# Altium project rf_modulator_source.PrjPcb (part 2 of 2)

## Sheet rf_modulator_source_temp_regulator.SchDoc: SPE Router
size 420 x 297 mm; Author: P. Daniel; CompanyName: WUT ISE; DrawnBy: P. Daniel; Organization: WUT ISE; Address1: WUT ISE; Address2: Nowowiejska 15/19 00-665 Warsaw; Address3: piotrmaciejdaniel@gmail.com; Revision: 1; SheetNumber: 2; SheetTotal: 2; ModifiedBy: -; CreateDate: 02-03.2023; CheckedDate: -; Title2: PoE power supply; DivGrp: WUT ISE; Designer: Piotr Daniel
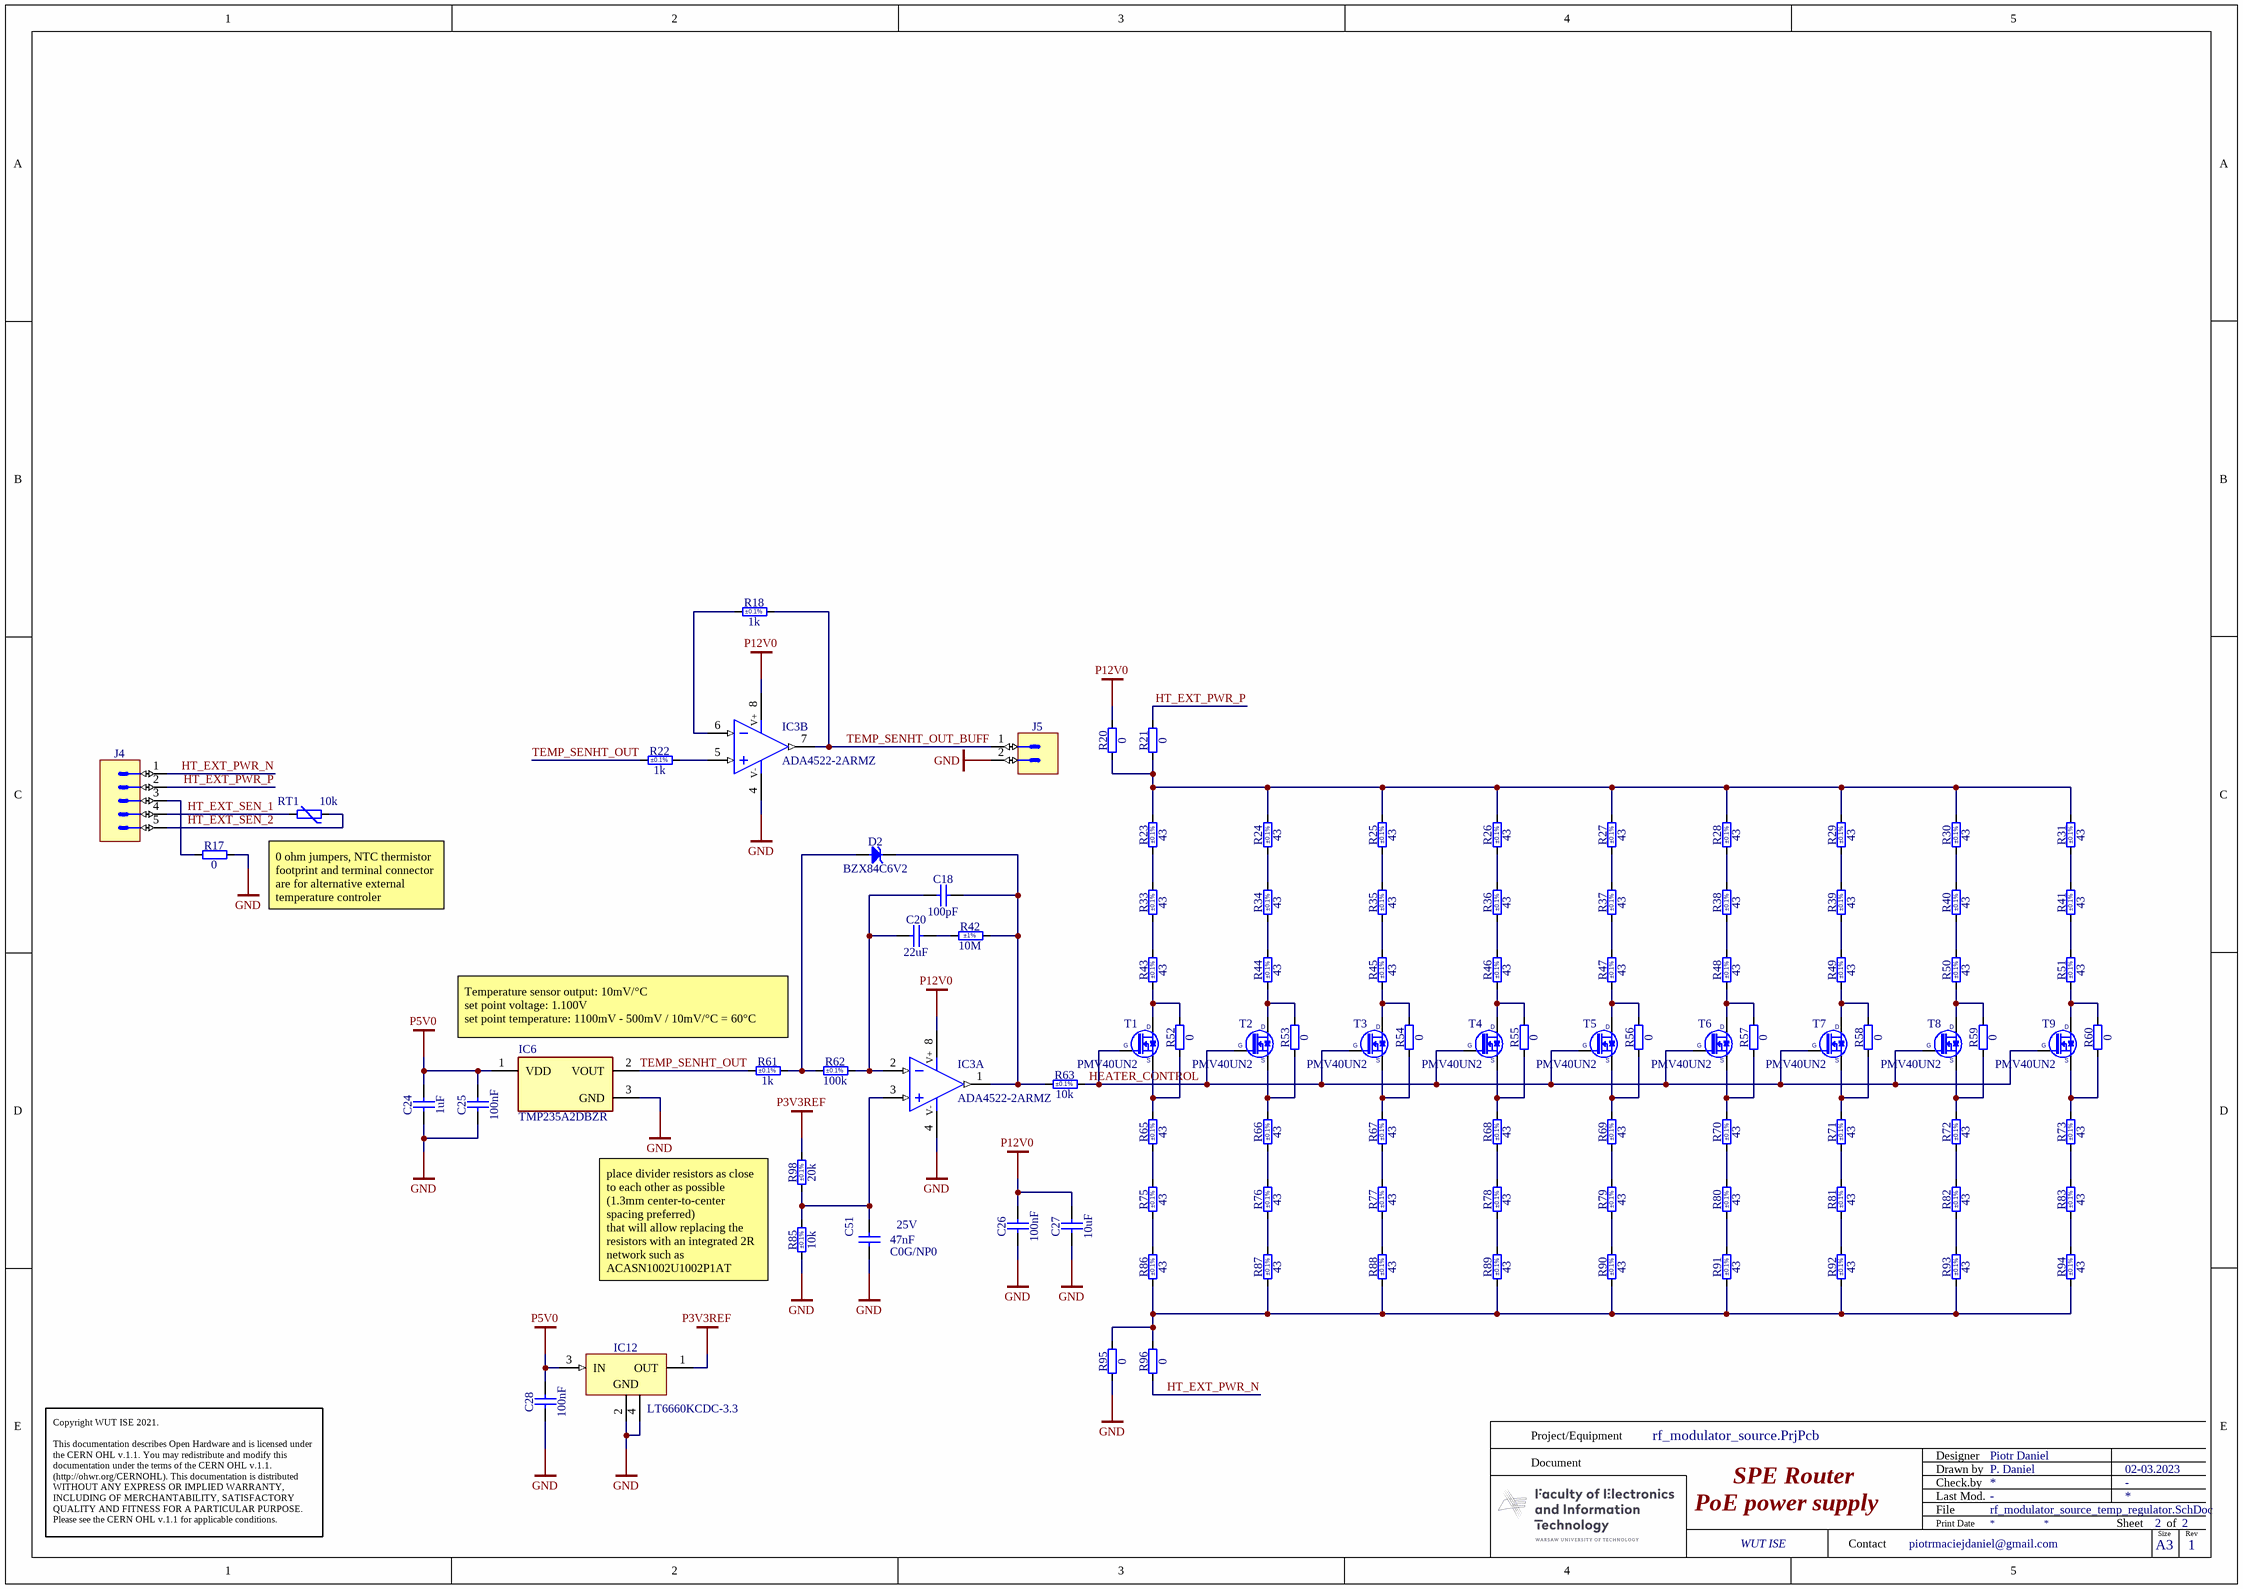
[diagram p1: rf_modulator_source_temp_regulator.SchDoc]

### Parts
C18  100pF  [CAPC1608X87N]
C20  22uF  [CAPC2012X135N]
C24  1uF  [CAPC1608X87N]
C25  100nF  [CAPC1005X55N]
C26  100nF  [CAPC1005X55N]
C27  10uF  [CAPC2012X135N]
C28  100nF  [CAPC1005X55N]
C51  47nF  Voltage: 25V  TC: C0G/NP0  [CAPC2012X135N]
D2  BZX84C6V2  [SOT95P248X115-3N]
IC3  ADA4522-2ARMZ  [SOP65P490X110-8N]  (parts A,B of 2)
IC6  TMP235A2DBZR  [FP-DBZ0003A-MFG]
IC12  LT6660KCDC-3.3  [ANALOG-DEVICES_DC-4]
J4  (no value)  [PHOENIX_1803303]
J5  KK®  [MOLEX_22-05-7028]  (value not drawn)
R17  0  [RESC2012X60N]
R18  1k  Tolerance: ±0.1%  [RESC1608X55N]
R20  0  [RESC2012X60N]
R21  0  [RESC2012X60N]
R22  1k  Tolerance: ±0.1%  [RESC1608X55N]
R23  43  Tolerance: ±0.1%  [RESC3216X65N]
R24  43  Tolerance: ±0.1%  [RESC3216X65N]
R25  43  Tolerance: ±0.1%  [RESC3216X65N]
R26  43  Tolerance: ±0.1%  [RESC3216X65N]
R27  43  Tolerance: ±0.1%  [RESC3216X65N]
R28  43  Tolerance: ±0.1%  [RESC3216X65N]
R29  43  Tolerance: ±0.1%  [RESC3216X65N]
R30  43  Tolerance: ±0.1%  [RESC3216X65N]
R31  43  Tolerance: ±0.1%  [RESC3216X65N]
R33  43  Tolerance: ±0.1%  [RESC3216X65N]
R34  43  Tolerance: ±0.1%  [RESC3216X65N]
R35  43  Tolerance: ±0.1%  [RESC3216X65N]
R36  43  Tolerance: ±0.1%  [RESC3216X65N]
R37  43  Tolerance: ±0.1%  [RESC3216X65N]
R38  43  Tolerance: ±0.1%  [RESC3216X65N]
R39  43  Tolerance: ±0.1%  [RESC3216X65N]
R40  43  Tolerance: ±0.1%  [RESC3216X65N]
R41  43  Tolerance: ±0.1%  [RESC3216X65N]
R42  10M  Tolerance: ±1%  [RESC1608X55N]
R43  43  Tolerance: ±0.1%  [RESC3216X65N]
R44  43  Tolerance: ±0.1%  [RESC3216X65N]
R45  43  Tolerance: ±0.1%  [RESC3216X65N]
R46  43  Tolerance: ±0.1%  [RESC3216X65N]
R47  43  Tolerance: ±0.1%  [RESC3216X65N]
R48  43  Tolerance: ±0.1%  [RESC3216X65N]
R49  43  Tolerance: ±0.1%  [RESC3216X65N]
R50  43  Tolerance: ±0.1%  [RESC3216X65N]
R51  43  Tolerance: ±0.1%  [RESC3216X65N]
R52  0  [RESC1608X55N]
R53  0  [RESC1608X55N]
R54  0  [RESC1608X55N]
R55  0  [RESC1608X55N]
R56  0  [RESC1608X55N]
R57  0  [RESC1608X55N]
R58  0  [RESC1608X55N]
R59  0  [RESC1608X55N]
R60  0  [RESC1608X55N]
R61  1k  Tolerance: ±0.1%  [RESC1608X55N]
R62  100k  Tolerance: ±0.1%  [RESC1608X55N]
R63  10k  Tolerance: ±0.1%  [RESC1608X55N]
R65  43  Tolerance: ±0.1%  [RESC3216X65N]
R66  43  Tolerance: ±0.1%  [RESC3216X65N]
R67  43  Tolerance: ±0.1%  [RESC3216X65N]
R68  43  Tolerance: ±0.1%  [RESC3216X65N]
R69  43  Tolerance: ±0.1%  [RESC3216X65N]
R70  43  Tolerance: ±0.1%  [RESC3216X65N]
R71  43  Tolerance: ±0.1%  [RESC3216X65N]
R72  43  Tolerance: ±0.1%  [RESC3216X65N]
R73  43  Tolerance: ±0.1%  [RESC3216X65N]
R75  43  Tolerance: ±0.1%  [RESC3216X65N]
R76  43  Tolerance: ±0.1%  [RESC3216X65N]
R77  43  Tolerance: ±0.1%  [RESC3216X65N]
R78  43  Tolerance: ±0.1%  [RESC3216X65N]
R79  43  Tolerance: ±0.1%  [RESC3216X65N]
R80  43  Tolerance: ±0.1%  [RESC3216X65N]
R81  43  Tolerance: ±0.1%  [RESC3216X65N]
R82  43  Tolerance: ±0.1%  [RESC3216X65N]
R83  43  Tolerance: ±0.1%  [RESC3216X65N]
R85  10k  Tolerance: ±0.1%  [RESC1608X55N]
R86  43  Tolerance: ±0.1%  [RESC3216X65N]
R87  43  Tolerance: ±0.1%  [RESC3216X65N]
R88  43  Tolerance: ±0.1%  [RESC3216X65N]
R89  43  Tolerance: ±0.1%  [RESC3216X65N]
R90  43  Tolerance: ±0.1%  [RESC3216X65N]
R91  43  Tolerance: ±0.1%  [RESC3216X65N]
R92  43  Tolerance: ±0.1%  [RESC3216X65N]
R93  43  Tolerance: ±0.1%  [RESC3216X65N]
R94  43  Tolerance: ±0.1%  [RESC3216X65N]
R95  0  [RESC2012X60N]
R96  0  [RESC2012X60N]
R98  20k  Tolerance: ±0.1%  [RESC1608X55N]
RT1  10k  [THERMC1608X90N]
T1  PMV40UN2  [SOT95P230X110-3N]
T2  PMV40UN2  [SOT95P230X110-3N]
T3  PMV40UN2  [SOT95P230X110-3N]
T4  PMV40UN2  [SOT95P230X110-3N]
T5  PMV40UN2  [SOT95P230X110-3N]
T6  PMV40UN2  [SOT95P230X110-3N]
T7  PMV40UN2  [SOT95P230X110-3N]
T8  PMV40UN2  [SOT95P230X110-3N]
T9  PMV40UN2  [SOT95P230X110-3N]

### Nets
GND: C24.1 C25.1 C26.1 C27.1 C28.1 C51.1 IC3.4(V-) IC6.3(GND) IC12.2(GND) IC12.4(GND) J5.2 R17.2 R85.1 R95.1
P3V3REF: IC12.1(OUT) R98.2
P5V0: C24.2 C25.2 C28.2 IC6.1(VDD) IC12.3(IN)
P12V0: C26.2 C27.2 IC3.8(V+) R20.2
HEATER_CONTROL: R63.2 T1.1(G) T2.1(G) T3.1(G) T4.1(G) T5.1(G) T6.1(G) T7.1(G) T8.1(G) T9.1(G)
HT_EXT_PWR_N: J4.1 R96.1
HT_EXT_PWR_P: J4.2 R21.2
HT_EXT_SEN_1: J4.4 RT1.1
HT_EXT_SEN_2: J4.5 RT1.2
TEMP_SENHT_OUT: IC6.2(VOUT) R22.1 R61.1
TEMP_SENHT_OUT_BUFF: IC3.7(OUT) J5.1 R18.2
NetC18_1: C18.1 C20.1 IC3.2(IN-) R62.2
NetC18_2: C18.2 D2.3(C) IC3.1(OUT) R42.2 R63.1
NetC20_2: C20.2 R42.1
NetC51_2: C51.2 IC3.3(IN+) R85.2 R98.1
NetD2_1: D2.1(A) R61.2 R62.1
NetIC3_5: IC3.5(IN+) R22.2
NetIC3_6: IC3.6(IN-) R18.1
NetJ4_3: J4.3 R17.1
NetR20_1: R20.1 R21.1 R23.2 R24.2 R25.2 R26.2 R27.2 R28.2 R29.2 R30.2 R31.2
NetR23_1: R23.1 R33.2
NetR24_1: R24.1 R34.2
NetR25_1: R25.1 R35.2
NetR26_1: R26.1 R36.2
NetR27_1: R27.1 R37.2
NetR28_1: R28.1 R38.2
NetR29_1: R29.1 R39.2
NetR30_1: R30.1 R40.2
NetR31_1: R31.1 R41.2
NetR33_1: R33.1 R43.2
NetR34_1: R34.1 R44.2
NetR35_1: R35.1 R45.2
NetR36_1: R36.1 R46.2
NetR37_1: R37.1 R47.2
NetR38_1: R38.1 R48.2
NetR39_1: R39.1 R49.2
NetR40_1: R40.1 R50.2
NetR41_1: R41.1 R51.2
NetR43_1: R43.1 R52.2 T1.3(D)
NetR44_1: R44.1 R53.2 T2.3(D)
NetR45_1: R45.1 R54.2 T3.3(D)
NetR46_1: R46.1 R55.2 T4.3(D)
NetR47_1: R47.1 R56.2 T5.3(D)
NetR48_1: R48.1 R57.2 T6.3(D)
NetR49_1: R49.1 R58.2 T7.3(D)
NetR50_1: R50.1 R59.2 T8.3(D)
NetR51_1: R51.1 R60.2 T9.3(D)
NetR52_1: R52.1 R65.2 T1.2(S)
NetR53_1: R53.1 R66.2 T2.2(S)
NetR54_1: R54.1 R67.2 T3.2(S)
NetR55_1: R55.1 R68.2 T4.2(S)
NetR56_1: R56.1 R69.2 T5.2(S)
NetR57_1: R57.1 R70.2 T6.2(S)
NetR58_1: R58.1 R71.2 T7.2(S)
NetR59_1: R59.1 R72.2 T8.2(S)
NetR60_1: R60.1 R73.2 T9.2(S)
NetR65_1: R65.1 R75.2
NetR66_1: R66.1 R76.2
NetR67_1: R67.1 R77.2
NetR68_1: R68.1 R78.2
NetR69_1: R69.1 R79.2
NetR70_1: R70.1 R80.2
NetR71_1: R71.1 R81.2
NetR72_1: R72.1 R82.2
NetR73_1: R73.1 R83.2
NetR75_1: R75.1 R86.2
NetR76_1: R76.1 R87.2
NetR77_1: R77.1 R88.2
NetR78_1: R78.1 R89.2
NetR79_1: R79.1 R90.2
NetR80_1: R80.1 R91.2
NetR81_1: R81.1 R92.2
NetR82_1: R82.1 R93.2
NetR83_1: R83.1 R94.2
NetR86_1: R86.1 R87.1 R88.1 R89.1 R90.1 R91.1 R92.1 R93.1 R94.1 R95.2 R96.2

### Notes on the sheet
- 0 ohm jumpers, NTC thermistor footprint and terminal connector are for alternative external temperature controler
- Temperature sensor output: 10mV/°C
  set point voltage: 1.100V
  set point temperature: 1100mV - 500mV / 10mV/°C = 60°C
- place divider resistors as close to each other as possible (1.3mm center-to-center spacing preferred)
  that will allow replacing the resistors with an integrated 2R network such as ACASN1002U1002P1AT
- Project/Equipment
- Document
- Designer
- Drawn by
- Check.by
- Copyright WUT ISE 2021.
  This documentation describes Open Hardware and is licensed under the CERN OHL v.1.1. You may redistribute and modify this documentation under the terms of the CERN OHL v.1.1. (http://ohwr.org/CERNOHL). This documentation is distributed WITHOUT ANY EXPRESS OR IMPLIED WARRANTY, INCLUDING OF MERCHANTABILITY, SATISFACTORY QUALITY AND FITNESS FOR A PARTICULAR PURPOSE. Please see the CERN OHL v.1.1 for applicable conditions.
- Contact
- File
- Last Mod.
- Print Date
- Sheet
- Size
- A3
- of
- Rev

### Library data of the parts
C18 = CC0603_100PF_50V_5%_NP0: Non-polarised capacitor; Part Description: SMD Multilayer Chip Ceramic Capacitor; Manufacturer: GENERIC; Manufacturer1 Part Number: 223886715101; Voltage: 50V; TC: C0G/NP0; Tolerance: ±5%; Part Number: CC0603_100PF_50V_5%_NP0; Component Kind: Standard; Component Type: Standard; Pin Count: 2; Value: 100pF; Status: Preferred; Manufacturer Part Number: CC0603_100PF_50V_5%_NP0; Case: 0603; Mounted: Yes; Socket: No; SMD: Yes; Sense: No; Manufacturer1 Example: PHYCOMP; Manufacturer1 ComponentHeight: 0.87mm; HelpURL: \\cern.ch\dfs\Applications\Altium\Datasheets\CC0603_NP0_PHYCOMP.pdf; Author: CERN DEM JLC; CreateDate: 03.12.2007; LatestRevisionDate: 03.12.2007
C20 = CC0805_22UF_16V_10%_X5R: Non-polarised capacitor; Part Description: SMD Multilayer Chip Ceramic Capacitor; Manufacturer: GENERIC; Manufacturer1 Part Number: C2012X5R1C226KT; Voltage: 16V; TC: X5R; Tolerance: ±10%; Part Number: CC0805_22UF_16V_10%_X5R; Component Kind: Standard; Component Type: Standard; Pin Count: 2; Value: 22uF; Status: Preferred; Manufacturer Part Number: CC0805_22UF_16V_10%_X5R; Case: 0805; Mounted: Yes; Socket: No; SMD: Yes; Sense: No; Manufacturer1 Example: TDK; Manufacturer1 ComponentHeight: 1.35mm; HelpURL: \\cern.ch\dfs\Applications\Altium\Datasheets\CC0805_X5R_TDK_C.pdf; Author: CERN DEM JLC; CreateDate: 25.10.2012; LatestRevisionDate: 25.10.2012
C24 = CC0603_1UF_25V_10%_X7R: Non-polarised capacitor; Part Description: SMD Multilayer Chip Ceramic Capacitor; Manufacturer: GENERIC; Manufacturer1 Part Number: GRM188R71E105KA12D; Voltage: 25V; TC: X7R; Tolerance: ±10%; Part Number: CC0603_1UF_25V_10%_X7R; Component Kind: Standard; Component Type: Standard; Pin Count: 2; Value: 1uF; Status: None; Manufacturer Part Number: CC0603_1UF_25V_10%_X7R; Case: 0603; Mounted: Yes; Socket: No; SMD: Yes; Sense: No; Manufacturer1 Example: MURATA; Manufacturer1 ComponentHeight: 0.9mm; HelpURL: \\cern.ch\dfs\Applications\Altium\Datasheets\CC0603_X7R_MURATA.pdf; Author: CERN DEM JLC; CreateDate: 18.01.2011; LatestRevisionDate: 18.01.2011
C25 C26 C28 = CC0402_100NF_16V_10%_X7R: Non-polarised capacitor; Part Description: SMD Multilayer Chip Ceramic Capacitor; Manufacturer: GENERIC; Manufacturer1 Part Number: GRM155R71C104KA88D; Voltage: 16V; TC: X7R; Tolerance: ±10%; Part Number: CC0402_100NF_16V_10%_X7R; Component Kind: Standard; Component Type: Standard; Pin Count: 2; Value: 100nF; Status: Not Recommended; Manufacturer Part Number: CC0402_100NF_16V_10%_X7R; Case: 0402; Mounted: Yes; Socket: No; SMD: Yes; Sense: No; Manufacturer1 Example: MURATA; Manufacturer1 ComponentHeight: 0.55mm; HelpURL: \\cern.ch\dfs\Applications\Altium\Datasheets\CC0402_X7R_MURATA_GRM.pdf; Author: CERN DEM JLC; CreateDate: 05.12.2013; LatestRevisionDate: 03.12.2007
C27 = CC0805_10UF_10V_10%_X7R: Non-polarised capacitor; Part Description: SMD Multilayer Chip Ceramic Capacitor; Manufacturer: GENERIC; Manufacturer1 Part Number: GRM21BR71A106KE51L; Voltage: 10V; TC: X7R; Tolerance: ±10%; Part Number: CC0805_10UF_10V_10%_X7R; Component Kind: Standard; Component Type: Standard; Pin Count: 2; Value: 10uF; Status: Preferred; Manufacturer Part Number: CC0805_10UF_10V_10%_X7R; Case: 0805; Mounted: Yes; Socket: No; SMD: Yes; Sense: No; Manufacturer1 Example: MURATA; Manufacturer1 ComponentHeight: 1.35mm; HelpURL: \\cern.ch\dfs\Applications\Altium\Datasheets\CC0805_X7R_MURATA.pdf; Author: CERN DEM JLC; CreateDate: 30.04.2012; LatestRevisionDate: 30.04.2012
C51 = CC0805_47NF_25V_5%_C0G: Non-polarised capacitor; Part Description: SMD Multilayer Chip Ceramic Capacitor; Manufacturer: GENERIC; Manufacturer1 Part Number: C0805C473J3GACTU; Tolerance: ±5%; Part Number: CC0805_47NF_25V_5%_C0G; Component Kind: Standard; Component Type: Standard; Pin Count: 2; Value: 47nF; Status: None; Manufacturer Part Number: CC0805_47NF_25V_5%_C0G; Case: 0805; Mounted: Yes; Socket: No; SMD: Yes; Sense: No; Manufacturer1 Example: KEMET; Manufacturer1 ComponentHeight: 1.4mm; HelpURL: \\cern.ch\dfs\Applications\Altium\Datasheets\CC0805_C0G_KEMET_(Commercial Grade).pdf; Author: CERN DEM JLC; CreateDate: 18/01/2011; LatestRevisionDate: 18/01/2011
D2 = BZX84C6V2: Diode Zener Anode Pin 1 Cathode Pin 3 (Pas de pin 2); Part Description: Small Signal Zener Diode; Manufacturer: VISHAY SEMICONDUCTORS; Voltage: 6V2; Power: 300mW; PressFit: No; Bonding: No; Part Number: BZX84C6V2; Component Kind: Standard; Component Type: Standard; Device: BZX84C6V2; PackageDescription: SOT, 0.95mm Pitch; 3 Pin, 1.315mm W X 2.95mm L X 1.15mm H body, IPC Medium Density; Manufacturer Part Number: BZX84C6V2; Pin Count: 3; Case: SOT23-3; Mounted: Yes; Socket: No; SMD: Yes; Sense: No; ComponentHeight: 1.15mm; HelpURL: \\cern.ch\dfs\Applications\Altium\Datasheets\BZX84C6V2.pdf; Author: CERN DEM BC; CreateDate: 10.10.2019; LatestRevisionDate: 10.10.2019
IC3 = ADA4522-2ARMZ: Dual Operational Amplifier; Part Description: 55V, EMI Enhanced, Zero Drift, Ultralow Noise, Dual Rail-to-Rail Output Operational Amplifier; Manufacturer: ANALOG DEVICES; PressFit: No; Bonding: No; Part Number: ADA4522-2ARMZ; Component Kind: Standard; Component Type: Standard; Device: ADA4522-2ARMZ; PackageDescription: SOP, 0.65mm Pitch; 8 Pin, 3.00mm W X 3.00mm L X 1.10mm H body, IPC Medium Density; Manufacturer Part Number: ADA4522-2ARM; Pin Count: 8; Case: MSOP8; Mounted: Yes; Socket: No; SMD: Yes; Sense: No; ComponentHeight: 1.1mm; Author: CERN DEM BC; HelpURL: \\cern.ch\dfs\Applications\Altium\Datasheets\ADA4522-2ARMZ.pdf; CreateDate: 28.07.2017; LatestRevisionDate: 31.03.2022
IC6 = CMP-04948-000003-1: LOW-POWER HIGH-ACCURACY ANALOG O; Manufacturer: Texas Instruments; Output Current: 500uA; Operating Supply Current: 9uA; Max Supply Voltage: 5.5V; Max Junction Temp: +150°C; Accuracy: 0.5%; Min Supply Voltage: 2.3V; Standoff Height: 0.01mm; Sensor Output: Analog Voltage; Ambient Temperature Range Low: -40°C; Device Class L2: Temperature and Humidity Sensors; Digikey Description: LOW-POWER HIGH-ACCURACY ANALOG O; Lead Free: Yes; Category: IC; Device Class L3: unset; Temperature Range Low: -40°C; Manufacturer Part Number: TMP235A2DBZR; ComponentLink2Description: Datasheet; Package: DBZ0003A; Octopart: https://octopart.com/tmp235a2dbzr-texas+instruments-94966376; Device Class L1: Sensors; Temperature Range High: +150°C; Height: 1.12mm; Temperature: -40°C to +150°C; RoHS: TRUE; Ambient Temperature Range High: +150°C; Automotive: No; ComponentLink2URL: http://www.ti.com/lit/ds/symlink/tmp235.pdf; Mouser Description: ±2°C Analog output temperature sensor, with 10mV /°C gain 3-SOT-23 -40 to 150; Part Number: TMP235A2DBZR
IC12 = LT6660KCDC-3.3: 3-Terminal Regulator 1=OUT 2=GND 3=IN 4=GND; Part Description: 3.3V, 20mA, Tiny Micropower Precision Series References; Manufacturer: ANALOG DEVICES; PressFit: No; Bonding: No; Part Number: LT6660KCDC-3.3; Component Kind: Standard; Component Type: Standard; Device: LT6660KCDC-3.3; PackageDescription: DFN, 0.50mm Pitch, 3 Pin, 2.00mm L X 2.00mm W X 0.80mm H body (w/Thermal Tab 1.05 X 1.40mm), ANALOG DEVICE DC; Manufacturer Part Number: LT6660KCDC-3.3; Pin Count: 4; Case: DFN4; Mounted: Yes; Socket: No; SMD: Yes; Sense: No; ComponentHeight: 0.8mm; HelpURL: \\cern.ch\dfs\Applications\Altium\Datasheets\LT6660.pdf; Author: CERN DEM BC; CreateDate: 22.04.2020; LatestRevisionDate: 22.04.2020
J4 = PHOENIX_1803303: Connector 5 Male; Part Description: 8A 160 V, Pitch: 3.81mm, 5 Positions  Right Angled Header; Manufacturer: PHOENIX CONTACT; Manufacturer Part Number: 1803303 (MC 1,5/ 5-G-3,81); PressFit: No; Part Number: PHOENIX_1803303; Component Kind: Standard; Component Type: Standard; Pin Count: 5; Mounted: Yes; Socket: No; SMD: No; Sense: No; Status: None; ComponentHeight: 7.25mm; HelpURL: \\cern.ch\dfs\Applications\Altium\Datasheets\PHOENIX_1803303.pdf; Author: CERN DEM JLC; CreateDate: 11.06.2013; LatestRevisionDate: 11.06.2013
J5 = MOLEX_22-05-7028: Connector 2 Male; Part Description: 2.54mm (.100") Pitch KK® Wire-To-Board Header, Right Angle, with Friction Lock, 2 Circuits; Manufacturer: MOLEX; PressFit: No; Part Number: MOLEX_22-05-7028; Component Kind: Standard; Component Type: Standard; Pin Count: 2; Family: KK®; Mounted: Yes; Socket: No; SMD: No; Sense: No; Status: None; Manufacturer Part Number: 22-05-7028; ComponentHeight: 5.8mm; HelpURL: \\cern.ch\dfs\Applications\Altium\Datasheets\MOLEX_22-05-7028.pdf; Author: CERN DEM JLC; CreateDate: 24.01.2011; LatestRevisionDate: 24.01.2011
R17 R20 R21 R95 R96 = R0805_0R_JUMPER: Resistor; Part Description: 2A (0.05R Max DC Resistance) Zero Ohm Jumper; Manufacturer: GENERIC; Manufacturer1 Part Number: NRC10Z0; PressFit: No; Part Number: R0805_0R_JUMPER; Component Kind: Standard; Component Type: Standard; Pin Count: 2; Value: 0; Status: Preferred; Manufacturer Part Number: R0805_0R_JUMPER; Case: 0805; Mounted: Yes; Sense: No; Socket: No; SMD: Yes; Manufacturer1 Example: NIC COMPONENT; Manufacturer1 ComponentHeight: 0.6mm; HelpURL: \\cern.ch\dfs\Applications\Altium\Datasheets\R0805_NIC_NRC.pdf; Author: CERN DEM JLC; CreateDate: 03.12.2007; LatestRevisionDate: 13.03.2008
R18 R22 R61 = R0603_1K_0.1%_0.063W_10PPM: Resistor - 0.1%; Part Description: Thin Film Chip Resistor; Manufacturer: GENERIC; Manufacturer1 Part Number: RN73C1J1K0BTG; Power: 0.063W; TC: ±10ppm; PressFit: No; Part Number: R0603_1K_0.1%_0.063W_10PPM; Component Kind: Standard; Component Type: Standard; Pin Count: 2; Value: 1k; Status: Not Recommended; Manufacturer Part Number: R0603_1K_0.1%_0.063W_10PPM; Case: 0603; Mounted: Yes; Sense: No; Socket: No; SMD: Yes; Manufacturer1 Example: TYCO HOLSWORTHY; Manufacturer1 ComponentHeight: 0.55mm; HelpURL: \\cern.ch\dfs\Applications\Altium\Datasheets\R0603_Tyco_RN73.pdf; Author: CERN DEM BC; CreateDate: 23.05.2016; LatestRevisionDate: 23.05.2016
R23-R31 R33-R41 R43-R51 R65-R73 R75-R83 R86-R94 = R1206_43R_0.1%_0.25W_25PPM: Resistor - 0.1%; Part Description: Thin Film Chip Resistor; Manufacturer: GENERIC; Manufacturer1 Part Number: RN73H2BTTD43R0B25; Power: 0.25W; TC: ±25ppm/°C; PressFit: No; Part Number: R1206_43R_0.1%_0.25W_25PPM; Component Kind: Standard; Component Type: Standard; Pin Count: 2; Value: 43; Status: Not Recommended; Manufacturer Part Number: R1206_43R_0.1%_0.25W_25PPM; Case: 1206; Mounted: Yes; Sense: No; Socket: No; SMD: Yes; Manufacturer1 Example: KOA; Manufacturer1 ComponentHeight: 0.70mm; HelpURL: \\cern.ch\dfs\Applications\Altium\Datasheets\R1206_KOA_RN73H.pdf; Author: CERN DEM JLC; CreateDate: 03.12.2007; LatestRevisionDate: 13.03.2008
R42 = R0603_10M_1%_0.1W_100PPM: Resistor - 1%; Part Description: General Purpose Thick Film Chip Resistor; Manufacturer: GENERIC; Manufacturer1 Part Number: CRCW060310M0FKEA; Power: 0.1W; TC: ±100ppm/°C; PressFit: No; Part Number: R0603_10M_1%_0.1W_100PPM; Component Kind: Standard; Component Type: Standard; Pin Count: 2; Value: 10M; Status: Preferred; Manufacturer Part Number: R0603_10M_1%_0.1W_100PPM; Case: 0603; Mounted: Yes; Sense: No; Socket: No; SMD: Yes; Manufacturer1 Example: VISHAY; Manufacturer1 ComponentHeight: 0.55mm; HelpURL: \\cern.ch\dfs\Applications\Altium\Datasheets\R0603_VISHAY_CRCW e3.pdf; Author: CERN DEM JLC; CreateDate: 12.01.2017; LatestRevisionDate: 12.01.2017
R52-R60 = R0603_0R_JUMPER: Resistor; Part Description: 1A (0.05R Max DC Resistance) Zero Ohm Jumper; Manufacturer: GENERIC; Manufacturer1 Part Number: NRC06Z0; PressFit: No; Part Number: R0603_0R_JUMPER; Component Kind: Standard; Component Type: Standard; Pin Count: 2; Value: 0; Status: Preferred; Manufacturer Part Number: R0603_0R_JUMPER; Case: 0603; Mounted: Yes; Sense: No; Socket: No; SMD: Yes; Manufacturer1 Example: NIC COMPONENT; Manufacturer1 ComponentHeight: 0.55mm; HelpURL: \\cern.ch\dfs\Applications\Altium\Datasheets\R0603_NIC_NRC.pdf; Author: CERN DEM JLC; CreateDate: 03.12.2007; LatestRevisionDate: 13.03.2008
R62 = R0603_100K_0.1%_0.063W_10PPM: Resistor - 0.1%; Part Description: Thin Film Chip Resistor; Manufacturer: GENERIC; Manufacturer1 Part Number: RN73C1J100KBTDF; Power: 0.063W; TC: ±10ppm; PressFit: No; Part Number: R0603_100K_0.1%_0.063W_10PPM; Component Kind: Standard; Component Type: Standard; Pin Count: 2; Value: 100k; Status: Not Recommended; Manufacturer Part Number: R0603_100K_0.1%_0.063W_10PPM; Case: 0603; Mounted: Yes; Sense: No; Socket: No; SMD: Yes; Manufacturer1 Example: TYCO HOLSWORTHY; Manufacturer1 ComponentHeight: 0.55mm; HelpURL: \\cern.ch\dfs\Applications\Altium\Datasheets\R0603_Tyco_RN73.pdf; Author: CERN DEM JLC; CreateDate: 03.12.2007; LatestRevisionDate: 13.03.2008
R63 R85 = R0603_10K_0.1%_0.063W_10PPM: Resistor - 0.1%; Part Description: Thin Film Chip Resistor; Manufacturer: GENERIC; Manufacturer1 Part Number: RN73C1J10KBTDF; Power: 0.063W; TC: ±10ppm; PressFit: No; Part Number: R0603_10K_0.1%_0.063W_10PPM; Component Kind: Standard; Component Type: Standard; Pin Count: 2; Value: 10k; Status: Not Recommended; Manufacturer Part Number: R0603_10K_0.1%_0.063W_10PPM; Case: 0603; Mounted: Yes; Sense: No; Socket: No; SMD: Yes; Manufacturer1 Example: TYCO HOLSWORTHY; Manufacturer1 ComponentHeight: 0.5mm; HelpURL: \\cern.ch\dfs\Applications\Altium\Datasheets\R0603_Tyco_RN73.pdf; Author: CERN DEM JLC; CreateDate: 03.12.2007; LatestRevisionDate: 13.03.2008
R98 = R0603_20K_0.1%_0.063W_10PPM: Resistor - 0.1%; Part Description: Thin Film Chip Resistor; Manufacturer: GENERIC; Manufacturer1 Part Number: RN73C1J20KBTDF; Power: 0.063W; TC: ±10ppm; PressFit: No; Part Number: R0603_20K_0.1%_0.063W_10PPM; Component Kind: Standard; Component Type: Standard; Pin Count: 2; Value: 20k; Status: Not Recommended; Manufacturer Part Number: R0603_20K_0.1%_0.063W_10PPM; Case: 0603; Mounted: Yes; Sense: No; Socket: No; SMD: Yes; Manufacturer1 Example: TYCO HOLSWORTHY; Manufacturer1 ComponentHeight: 0.5mm; HelpURL: \\cern.ch\dfs\Applications\Altium\Datasheets\R0603_Tyco_RN73.pdf; Author: CERN DEM JLC; CreateDate: 03.12.2007; LatestRevisionDate: 13.03.2008
RT1 = THERM_NTC_10K_EPCOS_B57330V2103J260: Thermistor NTC (Negative Temperature Coefficient); Part Description: SMD NTC Thermistor for Temperature Measurement; Manufacturer: EPCOS / TDK; Power: 180mW; Tolerance: ±5%; Part Number: THERM_NTC_10K_EPCOS_B57330V2103J260; Component Kind: Standard; Component Type: Standard; Pin Count: 2; Value: 10k; Status: None; Manufacturer Part Number: B57330V2103J260; Case: 0603; Mounted: Yes; Socket: No; SMD: Yes; Sense: No; ComponentHeight: 0.9mm; HelpURL: \\cern.ch\dfs\Applications\Altium\Datasheets\THERM_EPCOS_B573xxV2.pdf; Author: CERN DEM BC; CreateDate: 30.07.2015; LatestRevisionDate: 30.07.2015
T1-T9 = PMV40UN2: N-CHANNEL MOSFET WITH DIODE; Part Description: 30V 4.4A N-Channel Trench MOSFET; Manufacturer: NEXPERIA; PressFit: No; Bonding: No; Part Number: PMV40UN2; Component Kind: Standard; Component Type: Standard; Device: PMV40UN2; PackageDescription: SOT23, 0.95mm Pitch; 3 Pin, 1.30mm W X 2.90mm L X 1.10mm H body, IPC Medium Density; Manufacturer Part Number: PMV40UN2; Pin Count: 3; Case: SOT23-3; Mounted: Yes; Socket: No; SMD: Yes; Sense: No; ComponentHeight: 1.1mm; HelpURL: \\cern.ch\dfs\Applications\Altium\Datasheets\PMV40UN2.pdf; Author: CERN DEM BC; CreateDate: 23.04.2020; LatestRevisionDate: 23.04.2020

## Nets that join several sheets
GND: rf_modulator_source_top (108 pins), rf_modulator_source_temp_regulator (14 pins)
P5V0: rf_modulator_source_top (18 pins), rf_modulator_source_temp_regulator (5 pins)
P12V0: rf_modulator_source_top (8 pins), rf_modulator_source_temp_regulator (C26.2 C27.2 IC3.8 R20.2)

## Assembly variants
modulator: all parts fitted